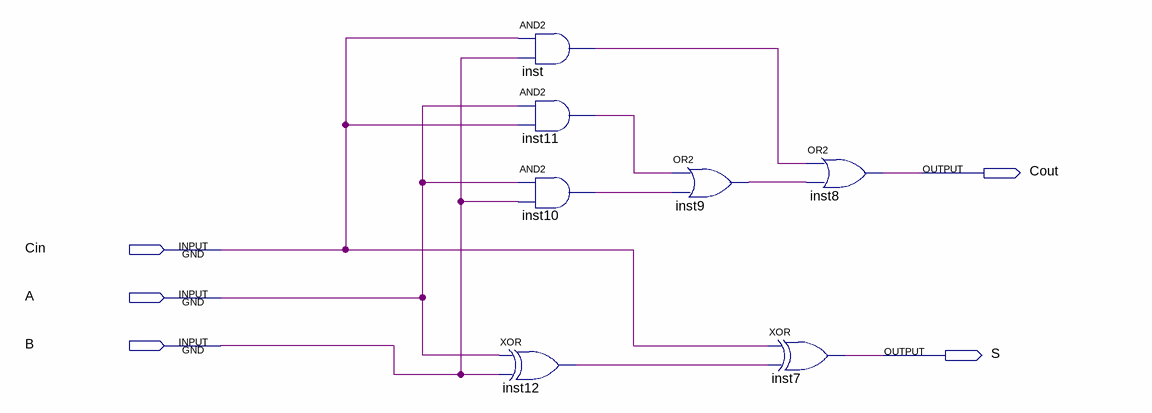
[diagram p0: schematic sheet]
// Quartus schematic fa.bdf as structural Verilog: 7 symbols, 5 pins
module fa (
  input  Cin,
  input  A,
  input  B,
  output Cout,
  output S
);

  wire inst9_out, inst10_out, inst11_out, inst12_out, inst_out;

  and inst (inst_out, Cin, B);
  and inst11 (inst11_out, A, Cin);
  and inst10 (inst10_out, A, B);
  xor inst12 (inst12_out, A, B);
  or inst9 (inst9_out, inst11_out, inst10_out);
  xor inst7 (S, Cin, inst12_out);
  or inst8 (Cout, inst_out, inst9_out);
endmodule
